# Altium schematic sheet Mechanical.SchDoc
size A3; SheetNumber: 35; SheetTotal: 41
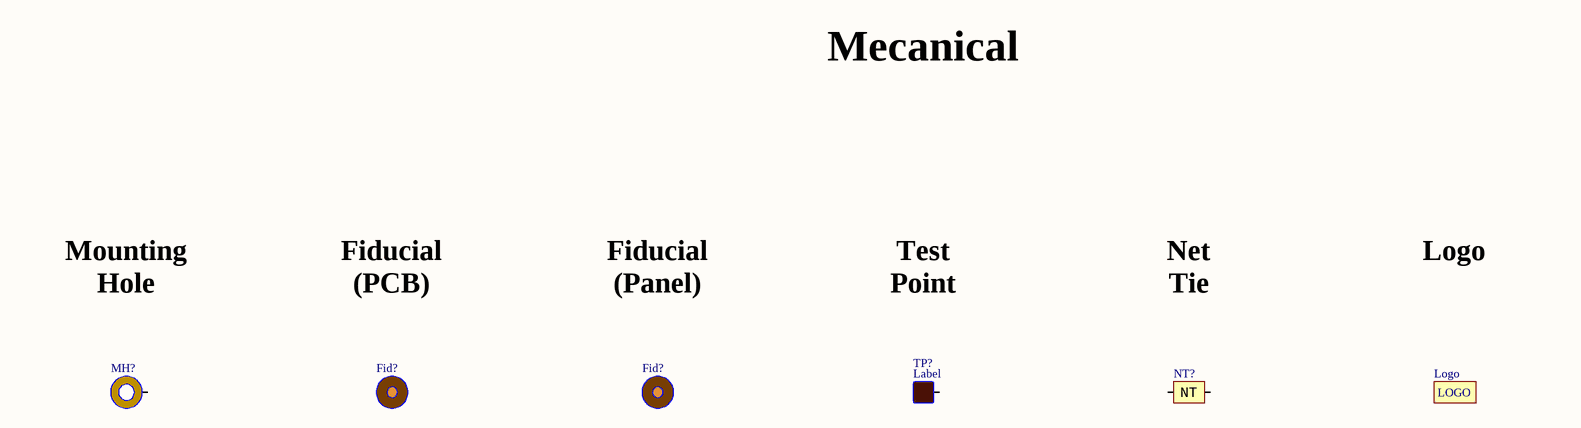
[diagram p0: Mechanical.SchDoc]

## Parts
(Parts that share a designator on the sheet are numbered #1, #2 ... from top to bottom, then left to right.)
Fid?#1  Fiducial  [Fiducial - 2mm, 5mm]  (value not drawn)  (no BOM)
Fid?#2  Fiducial  [Fiducial, Panel - 2mm, 5mm]  (value not drawn)  (no BOM)
Logo  Logo  [Logo 1]  (value not drawn)  (no BOM)
MH?  Mounting Hole  [Mounting Hole - Hole-3.2mm, Pad-5mm]  (value not drawn)  (no BOM)
NT?  Net Tie  [Net Tie - 1mm]  (value not drawn)  (no BOM)
TP?  Test Point  [Test Point - SMD, Circular, Diameter-1mm]  (value not drawn)  (no BOM)

## Nets

Not connected (* = marked no-connect by the designer): MH? Hole; NT? 1 2; TP? TP

## Notes on the sheet
- Mecanical
- Mounting
  Hole
- Fiducial
  (PCB)
- Fiducial
  (Panel)
- Test
  Point
- Net
  Tie
- Logo
- (in symbol Logo) LOGO
- (in symbol Net Tie) NT

## Library data of the parts
Fid?#1 = Fiducial: Mechanical, Fiducial, PCB, 2mm/5mm; Component Type: Fiducial; Component Category: Mechanical
Fid?#2 = Fiducial: Mechanical, Fiducial, Panel, 2mm/5mm; Component Type: Fiducial; Component Category: Mechanical
Logo = Logo: Mechanical, Logo; Component Type: Logo; Component Category: Mechanical
MH? = Mounting Hole: Mechanical, Mounting Hole; Component Type: Mounting Hole; Component Category: Mechanical
NT? = Net Tie: Mechanical, Net Tie, 1mm; Component Type: Test Point; Component Category: Mechanical; ComponentLink1Description: Datasheet; ComponentLink1URL: E:\Altium\Datasheets\Mechanical\Net Ties and How to Use Them.pdf
TP? = Test Point: Mechanical, Test Point, Circular, 1mm; Component Type: Test Point; Component Category: Mechanical; Label: Label